# Altium schematic sheet RTDsSheet2.SchDoc
size A4
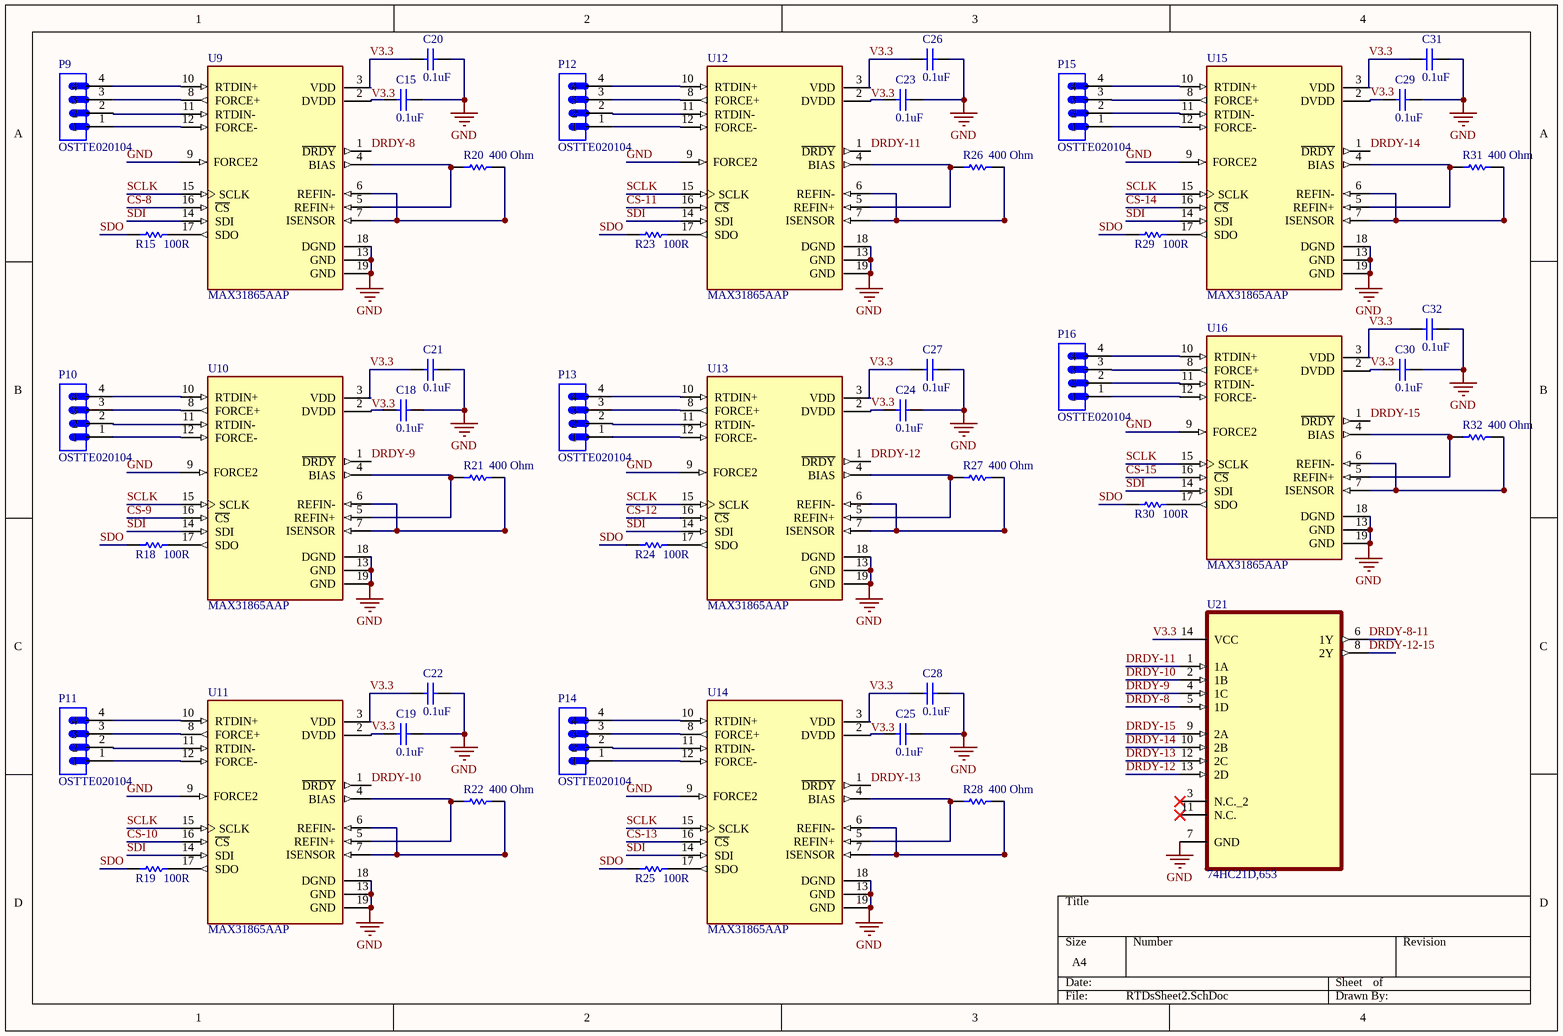
[diagram p0: RTDsSheet2.SchDoc]

## Parts
C15  value 0.1uF  [1608[0603]]
C18  value 0.1uF  [1608[0603]]
C19  value 0.1uF  [1608[0603]]
C20  value 0.1uF  [1608[0603]]
C21  value 0.1uF  [1608[0603]]
C22  value 0.1uF  [1608[0603]]
C23  value 0.1uF  [1608[0603]]
C24  value 0.1uF  [1608[0603]]
C25  value 0.1uF  [1608[0603]]
C26  value 0.1uF  [1608[0603]]
C27  value 0.1uF  [1608[0603]]
C28  value 0.1uF  [1608[0603]]
C29  value 0.1uF  [1608[0603]]
C30  value 0.1uF  [1608[0603]]
C31  value 0.1uF  [1608[0603]]
C32  value 0.1uF  [1608[0603]]
P9  OSTTE020104  [TE_3-641209-4]
P10  OSTTE020104  [TE_3-641209-4]
P11  OSTTE020104  [TE_3-641209-4]
P12  OSTTE020104  [TE_3-641209-4]
P13  OSTTE020104  [TE_3-641209-4]
P14  OSTTE020104  [TE_3-641209-4]
P15  OSTTE020104  [TE_3-641209-4]
P16  OSTTE020104  [TE_3-641209-4]
R15  value 100R  [1608[0603]]
R18  value 100R  [1608[0603]]
R19  value 100R  [1608[0603]]
R20  value 400 Ohm  [6-0805_M]
R21  value 400 Ohm  [6-0805_M]
R22  value 400 Ohm  [6-0805_M]
R23  value 100R  [1608[0603]]
R24  value 100R  [1608[0603]]
R25  value 100R  [1608[0603]]
R26  value 400 Ohm  [6-0805_M]
R27  value 400 Ohm  [6-0805_M]
R28  value 400 Ohm  [6-0805_M]
R29  value 100R  [1608[0603]]
R30  value 100R  [1608[0603]]
R31  value 400 Ohm  [6-0805_M]
R32  value 400 Ohm  [6-0805_M]
U9  MAX31865AAP  [SOP65P777X199-20N]
U10  MAX31865AAP  [SOP65P777X199-20N]
U11  MAX31865AAP  [SOP65P777X199-20N]
U12  MAX31865AAP  [SOP65P777X199-20N]
U13  MAX31865AAP  [SOP65P777X199-20N]
U14  MAX31865AAP  [SOP65P777X199-20N]
U15  MAX31865AAP  [SOP65P777X199-20N]
U16  MAX31865AAP  [SOP65P777X199-20N]
U21  74HC21D,653  [SOIC127P600X175-14N]

## Nets
GND: C15.1 C18.1 C19.1 C20.1 C21.1 C22.1 C23.1 C24.1 C25.1 C26.1 C27.1 C28.1 C29.1 C30.1 C31.1 C32.1 U9.9(FORCE2) U9.13(GND) U9.18(DGND) U9.19(GND) U10.9(FORCE2) U10.13(GND) U10.18(DGND) U10.19(GND) U11.9(FORCE2) U11.13(GND) U11.18(DGND) U11.19(GND) U12.9(FORCE2) U12.13(GND) U12.18(DGND) U12.19(GND) U13.9(FORCE2) U13.13(GND) U13.18(DGND) U13.19(GND) U14.9(FORCE2) U14.13(GND) U14.18(DGND) U14.19(GND) U15.9(FORCE2) U15.13(GND) U15.18(DGND) U15.19(GND) U16.9(FORCE2) U16.13(GND) U16.18(DGND) U16.19(GND) U21.7(GND)
CS-8: U9.16(~{CS})
CS-9: U10.16(~{CS})
CS-10: U11.16(~{CS})
CS-11: U12.16(~{CS})
CS-12: U13.16(~{CS})
CS-13: U14.16(~{CS})
CS-14: U15.16(~{CS})
CS-15: U16.16(~{CS})
DRDY-8: U9.1(~{DRDY}) U21.5(1D)
DRDY-8-11: U21.6(1Y)
DRDY-9: U10.1(~{DRDY}) U21.4(1C)
DRDY-10: U11.1(~{DRDY}) U21.2(1B)
DRDY-11: U12.1(~{DRDY}) U21.1(1A)
DRDY-12: U13.1(~{DRDY}) U21.13(2D)
DRDY-12-15: U21.8(2Y)
DRDY-13: U14.1(~{DRDY}) U21.12(2C)
DRDY-14: U15.1(~{DRDY}) U21.10(2B)
DRDY-15: U16.1(~{DRDY}) U21.9(2A)
SCLK: U9.15(SCLK) U10.15(SCLK) U11.15(SCLK) U12.15(SCLK) U13.15(SCLK) U14.15(SCLK) U15.15(SCLK) U16.15(SCLK)
SDI: U9.14(SDI) U10.14(SDI) U11.14(SDI) U12.14(SDI) U13.14(SDI) U14.14(SDI) U15.14(SDI) U16.14(SDI)
SDO: R15.2 R18.2 R19.2 R23.2 R24.2 R25.2 R29.2 R30.2
V3.3: C15.2 C18.2 C19.2 C20.2 C21.2 C22.2 C23.2 C24.2 C25.2 C26.2 C27.2 C28.2 C29.2 C30.2 C31.2 C32.2 U9.2(DVDD) U9.3(VDD) U10.2(DVDD) U10.3(VDD) U11.2(DVDD) U11.3(VDD) U12.2(DVDD) U12.3(VDD) U13.2(DVDD) U13.3(VDD) U14.2(DVDD) U14.3(VDD) U15.2(DVDD) U15.3(VDD) U16.2(DVDD) U16.3(VDD) U21.14(VCC)
NetP9_1: P9.1 U9.12(FORCE-)
NetP9_2: P9.2 U9.11(RTDIN-)
NetP9_3: P9.3 U9.8(FORCE+)
NetP9_4: P9.4 U9.10(RTDIN+)
NetP10_1: P10.1 U10.12(FORCE-)
NetP10_2: P10.2 U10.11(RTDIN-)
NetP10_3: P10.3 U10.8(FORCE+)
NetP10_4: P10.4 U10.10(RTDIN+)
NetP11_1: P11.1 U11.12(FORCE-)
NetP11_2: P11.2 U11.11(RTDIN-)
NetP11_3: P11.3 U11.8(FORCE+)
NetP11_4: P11.4 U11.10(RTDIN+)
NetP12_1: P12.1 U12.12(FORCE-)
NetP12_2: P12.2 U12.11(RTDIN-)
NetP12_3: P12.3 U12.8(FORCE+)
NetP12_4: P12.4 U12.10(RTDIN+)
NetP13_1: P13.1 U13.12(FORCE-)
NetP13_2: P13.2 U13.11(RTDIN-)
NetP13_3: P13.3 U13.8(FORCE+)
NetP13_4: P13.4 U13.10(RTDIN+)
NetP14_1: P14.1 U14.12(FORCE-)
NetP14_2: P14.2 U14.11(RTDIN-)
NetP14_3: P14.3 U14.8(FORCE+)
NetP14_4: P14.4 U14.10(RTDIN+)
NetP15_1: P15.1 U15.12(FORCE-)
NetP15_2: P15.2 U15.11(RTDIN-)
NetP15_3: P15.3 U15.8(FORCE+)
NetP15_4: P15.4 U15.10(RTDIN+)
NetP16_1: P16.1 U16.12(FORCE-)
NetP16_2: P16.2 U16.11(RTDIN-)
NetP16_3: P16.3 U16.8(FORCE+)
NetP16_4: P16.4 U16.10(RTDIN+)
NetR15_1: R15.1 U9.17(SDO)
NetR18_1: R18.1 U10.17(SDO)
NetR19_1: R19.1 U11.17(SDO)
NetR20_1: R20.1 U9.6(REFIN-) U9.7(ISENSOR)
NetR20_2: R20.2 U9.4(BIAS) U9.5(REFIN+)
NetR21_1: R21.1 U10.6(REFIN-) U10.7(ISENSOR)
NetR21_2: R21.2 U10.4(BIAS) U10.5(REFIN+)
NetR22_1: R22.1 U11.6(REFIN-) U11.7(ISENSOR)
NetR22_2: R22.2 U11.4(BIAS) U11.5(REFIN+)
NetR23_1: R23.1 U12.17(SDO)
NetR24_1: R24.1 U13.17(SDO)
NetR25_1: R25.1 U14.17(SDO)
NetR26_1: R26.1 U12.6(REFIN-) U12.7(ISENSOR)
NetR26_2: R26.2 U12.4(BIAS) U12.5(REFIN+)
NetR27_1: R27.1 U13.6(REFIN-) U13.7(ISENSOR)
NetR27_2: R27.2 U13.4(BIAS) U13.5(REFIN+)
NetR28_1: R28.1 U14.6(REFIN-) U14.7(ISENSOR)
NetR28_2: R28.2 U14.4(BIAS) U14.5(REFIN+)
NetR29_1: R29.1 U15.17(SDO)
NetR30_1: R30.1 U16.17(SDO)
NetR31_1: R31.1 U15.6(REFIN-) U15.7(ISENSOR)
NetR31_2: R31.2 U15.4(BIAS) U15.5(REFIN+)
NetR32_1: R32.1 U16.6(REFIN-) U16.7(ISENSOR)
NetR32_2: R32.2 U16.4(BIAS) U16.5(REFIN+)

Not connected (* = marked no-connect by the designer): U21 3(N.C._2)* 11(N.C.)*

## Library data of the parts
C15 C18-C32 = Cap Semi: Capacitor (Semiconductor SIM Model); Published: 8-Jun-2000; LatestRevisionDate: 29-May-2009; LatestRevisionNote: IPC-7351 Footprint Added.; PackageReference: C1206; Publisher: Altium Limited; PackageDescription: Chip Capacitor
P9-P16 = OSTTE020104: Terminal Block 3.5mm 2pos Pcb; MF: {'manufacturer': u'On Shore'}; Availability: Unavailable; Package: None; MP: OSTTE020104; Value: *; Price: None
R15 R18-R32 = Res Semi: Semiconductor Resistor; Published: 8-Jun-2000; LatestRevisionDate: 17-Jul-2002; LatestRevisionNote: Re-released for DXP Platform.; PackageReference: AXIAL-0.5; Publisher: Altium Limited; PackageDescription: Axial Device, Thru-Hole; 2 Leads; 0.5 in Pin Spacing
U9-U16 = MAX31865AAP: Rtd To Digital Converter In Ssop Tr; MF: {'manufacturer': u'Maxim Integrated'}; Availability: Unavailable; Package: None; MP: MAX31865AAP; Value: *; Price: None
U21 = 74HC21D,653: Dual 4-input AND gate; MF: {'manufacturer': u'Nexperia USA'}; Value: *; Availability: Unavailable; Price: None; Package: None; MP: 74HC21D,653